# Altium schematic sheet filtro.SchDoc
size A
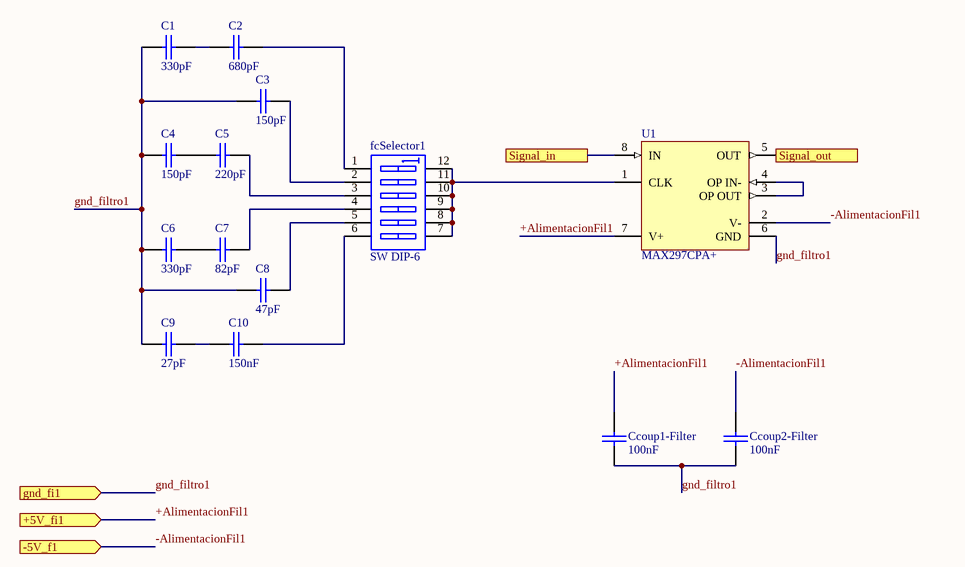
[diagram p0: filtro.SchDoc]

## Parts
C1  330pF  [CAP200]
C2  680pF  [CAP200]
C3  150pF  [CAP200]
C4  150pF  [CAP200]
C5  220pF  [CAP200]
C6  330pF  [CAP200]
C7  82pF  [CAP200]
C8  47pF  [CAP200]
C9  27pF  [CAP200]
C10  150nF  [CAP200]
Ccoup1-Filter  100nF  [CAP200]
Ccoup2-Filter  100nF  [CAP200]
fcSelector1  SW DIP-6  [DIP-12/SW]
U1  MAX297CPA+  [MAXM-P8+2]

## Ports
+5V_fi1 (in), -5V_f1 (in), gnd_fi1 (in), Signal_in, Signal_out

## Nets
+AlimentacionFil1: Ccoup1-Filter.2 U1.7(V+) ; port +5V_fi1
-AlimentacionFil1: Ccoup2-Filter.2 U1.2(V-) ; port -5V_f1
gnd_filtro1: C1.1 C3.1 C4.1 C6.1 C8.1 C9.1 Ccoup1-Filter.1 Ccoup2-Filter.1 U1.6(GND) ; port gnd_fi1
Signal_in: U1.8(IN) ; port Signal_in
Signal_out: U1.5(OUT) ; port Signal_out
NetC1_2: C1.2 C2.1
NetC2_2: C2.2 fcSelector1.1(A1)
NetC3_2: C3.2 fcSelector1.2(A2)
NetC4_2: C4.2 C5.1
NetC5_2: C5.2 fcSelector1.3(A3)
NetC6_2: C6.2 C7.1
NetC7_2: C7.2 fcSelector1.4(A4)
NetC8_2: C8.2 fcSelector1.5(A5)
NetC9_2: C9.2 C10.1
NetC10_2: C10.2 fcSelector1.6(A6)
NetfcSelector1_7: fcSelector1.7(B6) fcSelector1.8(B5) fcSelector1.9(B4) fcSelector1.10(B3) fcSelector1.11(B2) fcSelector1.12(B1) U1.1(CLK)
NetU1_3: U1.3(OP_OUT) U1.4(OP_IN-)

## Library data of the parts
C1-C10 Ccoup1-Filter Ccoup2-Filter = CAP
fcSelector1 = SW DIP-6: DIP Switch, 6 Position, SPST; Published: 24-Mar-1999; LatestRevisionDate: 17-Jul-2002; LatestRevisionNote: Re-released for DXP Platform.; PackageReference: DIP-12/SW; Publisher: Altium Limited; PackageDescription: DIP Switch; 12 Leads
U1 = MAX297CPA+: 8th-Order Switched Capacitor Lowpass Filter, Elliptic, 1.5 Transition Ratio, 0 to 70 degC, 8-Pin DIP (P8+2), Pb-Free; Generic Part Number: MAX297; Filter Sections: 1; Order Per Filter Section: 8; Program Method: Clock; DatasheetVersion: Rev. 2; PackageVersion: Rev. E, 04/2011; PackageReference: P8+2; PackageDescription: 8-Pin Plastic Dual-In-Line, Narrow (0.3in) (P8+2), Body 9.375 x 6.985 mm, Pitch 2.54 mm; Supplier 1: Digi-Key; Supplier Part Number 1: MAX297CPA+-ND; Supplier 2: Mouser; Supplier Part Number 2: 700-MAX297CPA; Filter Characteristic: Elliptic; Filter Class: Switched Cap; Filter Type: Lowpass; RoHS: Pb-Free; Mounting Technology: Through Hole; Code_JEDEC: MS001-XX; PartNumber: MAX297CPA+; ComponentLink1Description: Manufacturer URL; ComponentLink1URL: http://www.maximintegrated.com/; ComponentLink2Description: Datasheet; ComponentLink2URL: http://datasheets.maximintegrated.com/en/ds/MAX293-MAX297.pdf; ComponentLink3Description: Package Specification; ComponentLink3URL: http://pdfserv.maximintegrated.com/package_dwgs/21-0043.PDF